# EAGLE design NinjaFuge-DIP-171003 (EAGLE 6.6.0)
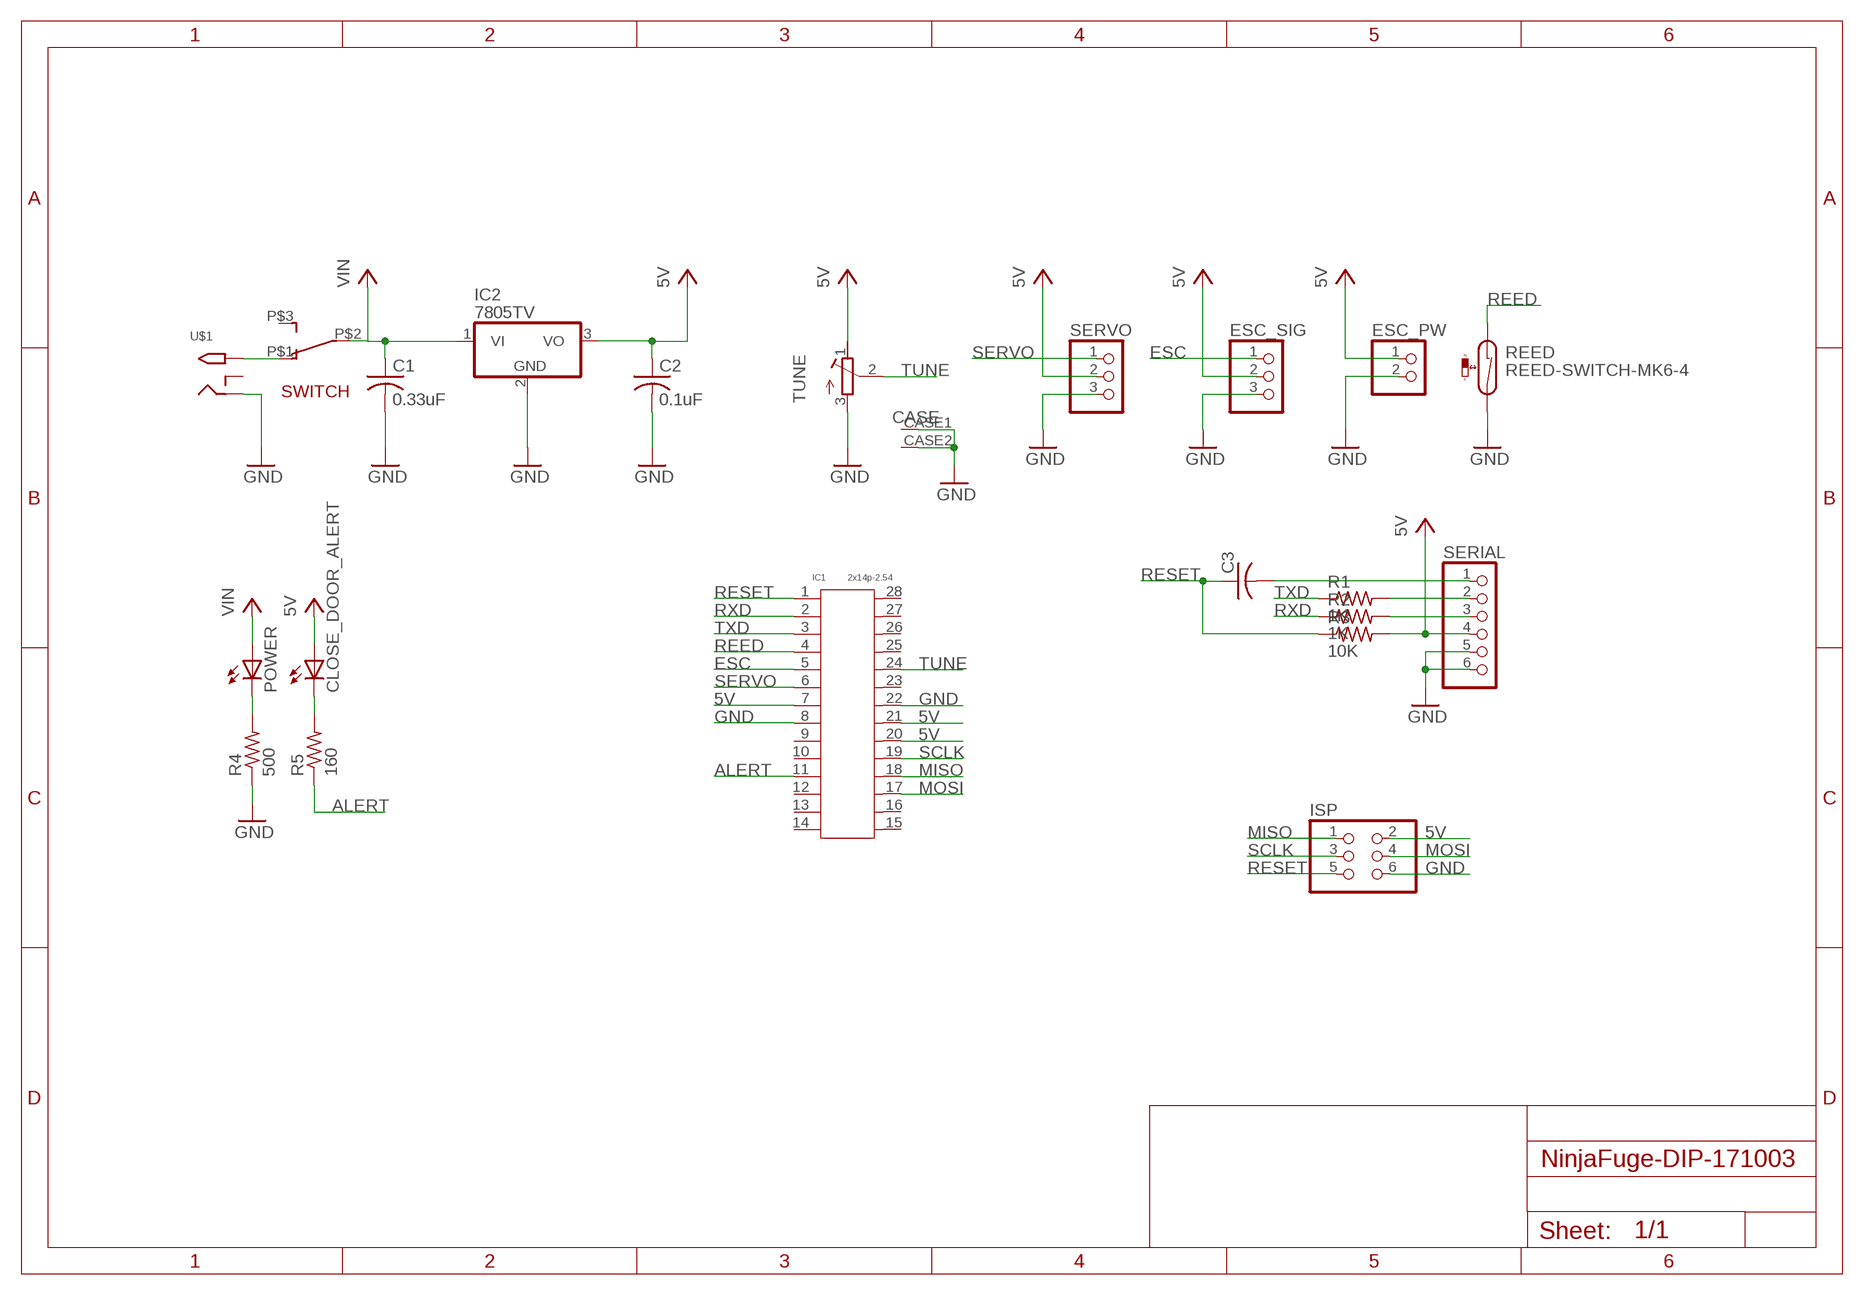
[diagram p0: schematic, sheet 1]

## Parts
C1  0.33uF  C-US050-024X044  [C050-024X044]
C2  0.1uF  C-US050-024X044  [C050-024X044]
C3  C-US050-024X044  [C050-024X044]
CLOSE_DOOR_ALERT  LED3MM  [LED3MM]
ESC_PW  PINHD-1X2  [1X02]
ESC_SIG  PINHD-1X3  [1X03]
IC1  2x14p-2.54  DIP-IC-SOCKET(2X14P-2.54)  [SCK28-2.54-35.6X10MM]
IC2  7805TV  [TO220V]
ISP  PINHD-2X3  [2X03]
POWER  LED3MM  [LED3MM]
R1  1K  R-US_0204/5  [0204/5]
R2  1K  R-US_0204/5  [0204/5]
R3  10K  R-US_0204/5  [0204/5]
R4  500  R-US_0204/5  [0204/5]
R5  160  R-US_0204/5  [0204/5]
REED  REED-SWITCH-MK6-4  [MK6-4]
SERIAL  PINHD-1X6  [1X06]
SERVO  PINHD-1X3  [1X03]
SWITCH  MARUSHIN_MSR5  [MARUSHIN_MSR5]
TUNE  RK09D117000B  [RK09D117000B]
U$1  2.1MMJACKTHM  [PJ-102A]

## Nets
5V: C2.1 CLOSE_DOOR_ALERT.A ESC_SIG.2 IC1.7 IC1.20 IC1.21 IC2.3(VO) ISP.2 R3.2 SERIAL.4 SERVO.2 TUNE.1
ALERT: IC1.11 R5.1
ESC: ESC_SIG.1 IC1.5
GND: C1.2 C2.2 ESC_PW.2 ESC_SIG.3 IC1.8 IC1.22 IC2.2(GND) ISP.6 R4.1 REED.2 SERIAL.5 SERIAL.6 SERVO.3 TUNE.3 TUNE.CASE1 TUNE.CASE2 U$1.RING
MISO: IC1.18 ISP.1
MOSI: IC1.17 ISP.4
N$1: SWITCH.P$1 U$1.TIP
N$2: R2.2 SERIAL.3
N$3: R1.2 SERIAL.2
N$4: POWER.K(C) R4.2
N$5: C3.2 SERIAL.1
N$6: CLOSE_DOOR_ALERT.K(C) R5.2
REED: IC1.4 REED.1
RESET: C3.1 IC1.1 ISP.5 R3.1
RXD: IC1.2 R2.1
SCLK: IC1.19 ISP.3
SERVO: IC1.6 SERVO.1
TUNE: IC1.24 TUNE.2
TXD: IC1.3 R1.1
VIN: C1.1 ESC_PW.1 IC2.1(VI) POWER.A SWITCH.P$2 ; supply symbol labelled 5V
Unconnected: IC1.9 IC1.10 IC1.12 IC1.13 IC1.14 IC1.15 IC1.16 IC1.23 IC1.25 IC1.26 IC1.27 IC1.28 SWITCH.P$3 U$1.RING_SW

## Library data of the parts
C1-C3 = rcl:C-US: CAPACITOR, American symbol
CLOSE_DOOR_ALERT POWER = led:LED: LED OSRAM: - CHIPLED LG R971, LG N971, LY N971, LG Q971, LY Q971, LO R971, LY R971 LH N974, LH R974 LS Q976, LO Q976, LY Q976 LO Q996 - Hyper CHIPLED LW Q18S LB Q993, LB Q99A, LB R99A - SideLED LS A670, LO A670, LY A670, LG A670, LP A670 LB A673, LV A673, LT A673, LW A673 LH A674 LY A675 LS A676, LA A676, LO A676, LY A676, LW A676 LS A679, LY A679, LG A679 - Hyper Micro SIDELED® LS Y876, LA Y876, LO Y876, LY Y876 LT Y87S - SmartLED LW L88C, LW L88S LB L89C, LB L89S, LG L890 LS L89K, LO L89K, LY L89K LS L896, LA L896, LO L896, LY L896 - TOPLED LS T670, LO T670, LY T670, LG T670, LP T670 LSG T670, LSP T670, LSY T670, LOP T670, LYG T670 LG T671, LOG T671, LSG T671 LB T673, LV T673, LT T673, LW T673 LH T674 LS T676, LA T676, LO T676, LY T676, LB T676, LH T676, LSB T676, LW T676 LB T67C, LV T67C, LT T67C, LS T67K, LO T67K, LY T67K, LW E67C LS E67B, LA E67B, LO E67B, LY E67B, LB E67C, LV E67C, LT E67C LW T67C LS T679, LY T679, LG T679 LS T770, LO T770, LY T770, LG T770, LP T770 LB T773, LV T773, LT T773, LW T773 LH T774 LS E675, LA E675, LY E675, LS T675 LS T776, LA T776, LO T776, LY T776, LB T776 LHGB T686 LT T68C, LB T68C - Hyper Mini TOPLED® LB M676 - Mini TOPLED Santana® LG M470 LS M47K, LO M47K, LY M47K Source: http://www.osram.convergy.de LUXEON: - LUMILED® LXK2-PW12-R00, LXK2-PW12-S00, LXK2-PW14-U00, LXK2-PW14-V00 LXK2-PM12-R00, LXK2-PM12-S00, LXK2-PM14-U00 LXK2-PE12-Q00, LXK2-PE12-R00, LXK2-PE12-S00, LXK2-PE14-T00, LXK2-PE14-U00 LXK2-PB12-K00, LXK2-PB12-L00, LXK2-PB12-M00, LXK2-PB14-N00, LXK2-PB14-P00, LXK2-PB14-Q00 LXK2-PR12-L00, LXK2-PR12-M00, LXK2-PR14-Q00, LXK2-PR14-R00 LXK2-PD12-Q00, LXK2-PD12-R00, LXK2-PD12-S00 LXK2-PH12-R00, LXK2-PH12-S00 LXK2-PL12-P00, LXK2-PL12-Q00, LXK2-PL12-R00 Source: www.luxeon.com KINGBRIGHT: KA-3528ASYC Source: www.kingbright.com
ESC_PW = pinhead:PINHD-1X2: PIN HEADER
ESC_SIG SERVO = pinhead:PINHD-1X3: PIN HEADER
IC1 = Seeed-Connector:DIP-IC-SOCKET(2X14P-2.54): 320070000; MPN: ICX-28P
IC2 = linear:78*: Positive VOLTAGE REGULATOR Source: http://cache.national.com/ds/LM/LM78L05.pdf http://www.fairchildsemi.com/ds/LM/LM7805.pdf
ISP = pinhead:PINHD-2X3: PIN HEADER
R1-R5 = rcl:R-US_: RESISTOR, American symbol
REED = switch-reed:REED-SWITCH-: Reed Sensor; OC_FARNELL: unknown
SERIAL = pinhead:PINHD-1X6: PIN HEADER
SWITCH = PCR-Switch:MARUSHIN_MSR5
TUNE = PCR-Resistor:RK09D117000B
U$1 = adafruit:2.1MMJACK: 2.1mm x 5.5mm THM DC jack with internal switch. Digikey part #PJ-102A, 4UCON part #05537 2.1mm x 5.5mm SMT DC jack with internal switch. Digikey part #PJ-002A-SMT, 4UCON part #03267 By microbuilder.eu & adafruit.com

## Board
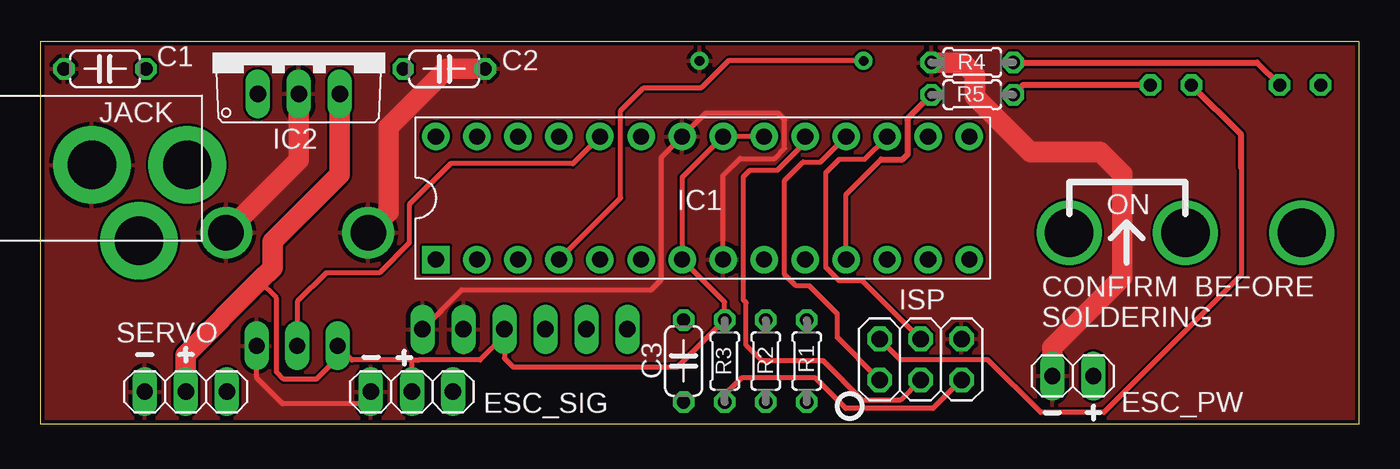
[diagram p1: board, top side]
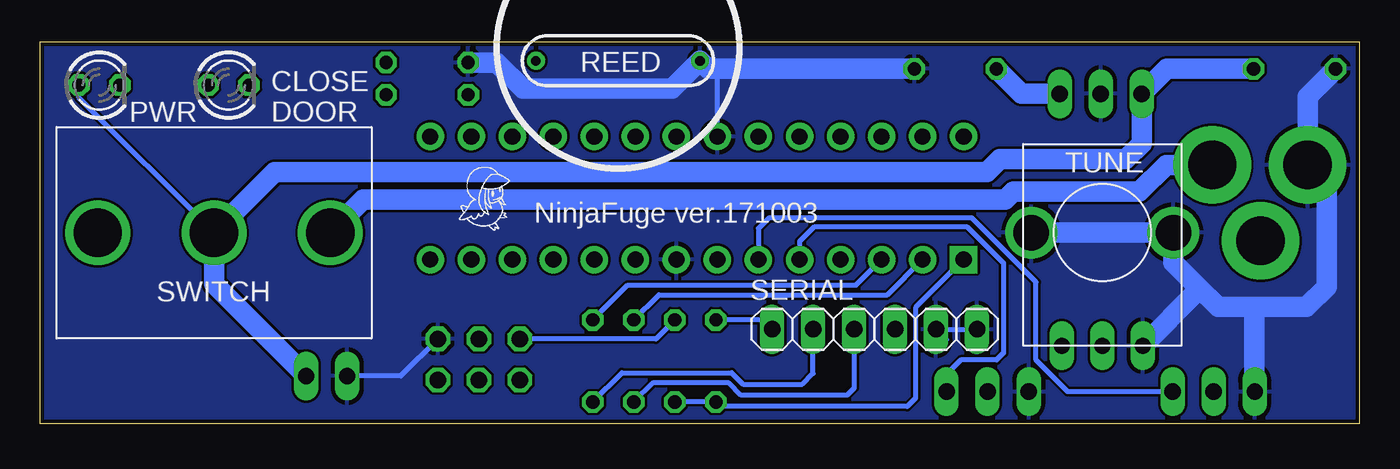
[diagram p2: board, bottom side, seen from below]

Size 81.65 x 23.7 mm. Coordinates in mm from the lower left corner, seen from the top.
Outline: 0,0 81.65,0 81.65,23.7 0,23.7 0,0
Copper layers (1*16): Top 0.035mm / dielectric 1.5mm / Bottom 0.035mm
Design rules "SeeedStudio_2layer_DRU_no_angle_20140221": minimum track width 6mil, minimum drill 12mil, track to track 6mil, track to pad 6mil, pad to pad 6mil, via to via 6mil, smd to smd 0mil, copper to edge 10mil, drill to drill 10mil, minimum pad ring 10mil, minimum via ring 6mil, stop-mask expansion 2mil, vias tented up to drill 100mil, thermal gap 10mil

### Footprints (pad centres in the part's own frame; a part is rotated, then mirrored left to right if it is on the bottom)
C050-024X044 = drill 0.813 octagon: 1 -2.54,0; 2 2.54,0
LED3MM = drill 0.813 octagon: A -1.27,0; K 1.27,0
1X02 = drill 1.016 long: 1 -1.27,0; 2 1.27,0
1X03 = drill 1.016 long: 1 -2.54,0; 2 0,0; 3 2.54,0
SCK28-2.54-35.6X10MM = drill 1 pad 1.7 square: 1 -16.51,-3.81 | drill 1 pad 1.7: 2 -13.97,-3.81; 3 -11.43,-3.81; 4 -8.89,-3.81; 5 -6.35,-3.81; 6 -3.81,-3.81; 7 -1.27,-3.81; 8 1.27,-3.81; 9 3.81,-3.81; 10 6.35,-3.81; 11 8.89,-3.81; 12 11.43,-3.81; 13 13.97,-3.81; 14 16.51,-3.81; 15 16.51,3.81; 16 13.97,3.81; 17 11.43,3.81; 18 8.89,3.81; 19 6.35,3.81; 20 3.81,3.81; 21 1.27,3.81; 22 -1.27,3.81; 23 -3.81,3.81; 24 -6.35,3.81; 25 -8.89,3.81; 26 -11.43,3.81; 27 -13.97,3.81; 28 -16.51,3.81
TO220V = drill 1.016 long: 1 -2.54,-2.54; 2 0,-2.54; 3 2.54,-2.54
2X03 = drill 1.016 octagon: 1 -2.54,-1.27; 2 -2.54,1.27; 3 0,-1.27; 4 0,1.27; 5 2.54,-1.27; 6 2.54,1.27
0204/5 = drill 0.813 octagon: 1 -2.54,0; 2 2.54,0
MK6-4 = drill 0.6 pad 1.016: 1 -5.08,0; 2 5.08,0
1X06 = drill 1.016 long: 1 -6.35,0; 2 -3.81,0; 3 -1.27,0; 4 1.27,0; 5 3.81,0; 6 6.35,0
MARUSHIN_MSR5 = drill 3: P$1 -7.2,0; P$2 0,0; P$3 7.2,0
RK09D117000B = drill 1 long: 1 -2.5,-7; 2 0,-7; 3 2.5,-7 | drill 2.2: CASE1 -4.4,0; CASE2 4.4,0
PJ-102A = drill 3 pad 4.8: RING 0.1,-3.39; RING_SW -4.6,-6.29; TIP 0.1,-9.29

### Placement (x,y rotation side)
C1  4,22 180 top
C2  25,22 0 top
C3  39.83,3.9 90 top
CLOSE_DOOR_ALERT  70,21 0 bottom
ESC_PW  63.93,2.97 180 top
ESC_SIG  23,2 180 top
IC1  41,14 0 top
IC2  16,23 0 top
ISP  54.5,4 0 top
POWER  78,21 0 bottom
R1  47.45,3.9 270 top
R2  44.91,3.9 270 top
R3  42.37,3.9 90 top
R4  330  [0204/5]  57.7,22.4 0 top
R5  100  [0204/5]  57.7,20.4 0 top
REED  45.89,22.5 0 bottom
SERIAL  30,5.86 0 bottom
SERVO  9,2 180 top
SWITCH  70.9,11.85 180 bottom
TUNE  15.9,11.85 0 bottom
U$1  -0.2,15.95 90 top
U$2  [TORI_0.125]  55.79,11.93 0 bottom

### Tracks (layer width: path | path; a pad name or v marks a point on that pad's centre or on a via)
5V
  Top 0.305: IC1.20 IC1.21 39.73,15.27 IC1.7 42.37,7.55 R3.2 39.46,3.53 29.27,3.53 28.73,4.07 SERIAL.4 28.73,5.45 27.24,3.96 23.42,3.96 23,3.96 | 23,3.96 19.29,3.96 TUNE.1 18.4,4.09 17.08,2.77 15.07,2.77 14.61,3.23 14.61,7.8 13.56,8.85 | 74.36,15.91 74.36,9.22 65.85,0.71 61.94,0.71 58.66,3.99 53.24,3.99 ISP.2 | ESC_SIG.2 23,3.96
  Top 0.381: 74.36,15.91 74.36,17.91 CLOSE_DOOR_ALERT.A
  Top 1.27: IC2.3 18.54,15.46 14.39,11.3 14.39,9.68 13.56,8.85 9,4.29 SERVO.2
  Bottom 0.305: R3.2 43.54,5.27 ISP.2
  Bottom 1.27: IC2.3 20.92,20.46 C2.1
ALERT
  Top 0.305: IC1.11 49.89,14.22 52.05,16.38
  Top 0.381: 52.05,16.38 53.38,16.38 53.7,16.71 53.7,18.95 R5.1
ESC
  Bottom 0.305: IC1.5 34.65,11.31 33.77,12.19 24.24,12.19 22.02,9.97 22.02,4.39 22.45,3.96 24.66,3.96 25.54,3.09 ESC_SIG.1
GND
  Top 0.305: IC1.8 42.27,15.41 43.32,16.46 45.48,16.46 46.09,17.07 46.09,18.85 45.68,19.25 41.17,19.25 IC1.22 38.47,16.55 38.47,8.97 37.8,8.31 26.09,8.31 SERIAL.6 | ESC_SIG.3 19.7,1.25 15.01,1.25 13.4,2.86 TUNE.3
  Top 1.27: IC2.2 16,16.35 TUNE.CASE2 | C2.2 25.18,22 21.57,18.39 21.57,13.12 TUNE.CASE1 | ESC_PW.2 62.66,4.74 66.99,9.07 66.99,15.49 65.64,16.84 61.3,16.84 57.87,20.27 57.87,21.64 57.11,22.4 R4.1
  Bottom 0.305: SERIAL.6 SERIAL.5 25.54,5.21 | ISP.6 59.34,2.97 ESC_PW.2 | IC1.22 39.73,21.42 40.45,22.14
  Bottom 1.27: C1.2 3.19,20.27 U$1.RING 2.02,14.88 2.02,8.48 3.26,7.24 6.49,7.24 | TUNE.CASE1 TUNE.CASE2 11.5,10.02 10,8.52 | 6.49,7.24 8.72,7.24 10,8.52 | SERVO.3 6.49,2.03 6.49,7.24 | TUNE.3 10,8.25 10,8.52 | C2.2 40.31,22 40.45,22.14 REED.2 42.53,20.78 51.77,20.78 53.4,22.4 R4.1
  pour Bottom: -1,25 83,25 83,-1 -1,-1
  pour Top: -2,26 84,26 84,-2 -2,-2
MISO
  Top 0.305: ISP.1 49.34,5.35 49.34,6.83 47.61,8.56 46.8,8.56 46.09,9.27 46.09,15.09 47.23,16.23 48.31,16.23 IC1.18
MOSI
  Top 0.305: ISP.4 50.91,8.87 49.46,8.87 48.62,9.7 48.62,15.57 49.46,16.41 51.03,16.41 IC1.17
N$1
  Bottom 1.27: U$1.TIP 11.95,16.05 13.6,14.4 21.4,14.4 21.9,13.89 61.66,13.89 SWITCH.P$1
N$2
  Bottom 0.305: SERIAL.3 31.27,2.22 31.71,1.78 38.26,1.78 39.02,2.54 43.73,2.54 R2.2
N$3
  Bottom 0.305: R1.2 45.64,3.17 38.85,3.17 38.13,2.46 34.48,2.46 33.81,3.13 SERIAL.2
N$4
  Top 0.381: R4.2 75.33,22.4 POWER.K
N$5
  Bottom 0.305: SERIAL.1 36.93,6.44 C3.2
N$6
  Top 0.381: CLOSE_DOOR_ALERT.K 60.84,21 R5.2
REED
  Top 0.305: REED.1 42.6,22.5 40.93,20.83 37.35,20.83 35.92,19.41 35.92,14.01 IC1.4
RESET
  Top 0.305: ISP.5 55.27,0.96 49.87,0.96 47.99,2.85 43.42,2.85 42.37,1.8 R3.1
  Bottom 0.305: IC1.1 27.47,7.21 27.47,1.6 27.98,1.09 39.56,1.09 C3.1 R3.1
RXD
  Bottom 0.305: R2.1 43.35,8 29.22,8 IC1.2
SCLK
  Top 0.305: ISP.3 53.24,1.47 50.91,1.47 48.47,3.91 44.66,3.91 43.7,4.88 43.7,7.52 43.52,7.7 43.52,15.32 43.93,15.72 45.63,15.72 47.35,17.45 IC1.19
SERVO
  Bottom 0.305: SERVO.1 18.04,2 20,3.96 20,8.79 23.99,12.78 36.53,12.78 37.19,12.12 IC1.6
TUNE
  Top 0.305: IC1.24 32.97,16.13 25.38,16.13 22.84,13.59 22.84,11.23 20.99,9.37 17.69,9.37 15.9,7.58 TUNE.2
TXD
  Bottom 0.305: R1.1 45.28,8.61 31.15,8.61 IC1.3
VIN
  Bottom 0.305: SWITCH.P$2 79.27,20.22 POWER.A
  Bottom 1.27: ESC_PW.1 70.9,8.68 SWITCH.P$2 67.15,15.6 23.05,15.6 22.23,16.41 14.44,16.41 13.46,17.39 IC2.1 11.92,22 C1.1

### Text on the board
tPlace: ON | CONFIRM BEFORE / SOLDERING
bPlace: CLOSE / DOOR | PWR | NinjaFuge ver.171003
tNames: JACK